# Altium schematic sheet 16-FPGA-02a.SchDoc
size B; SheetNumber: 16; SheetTotal: 22
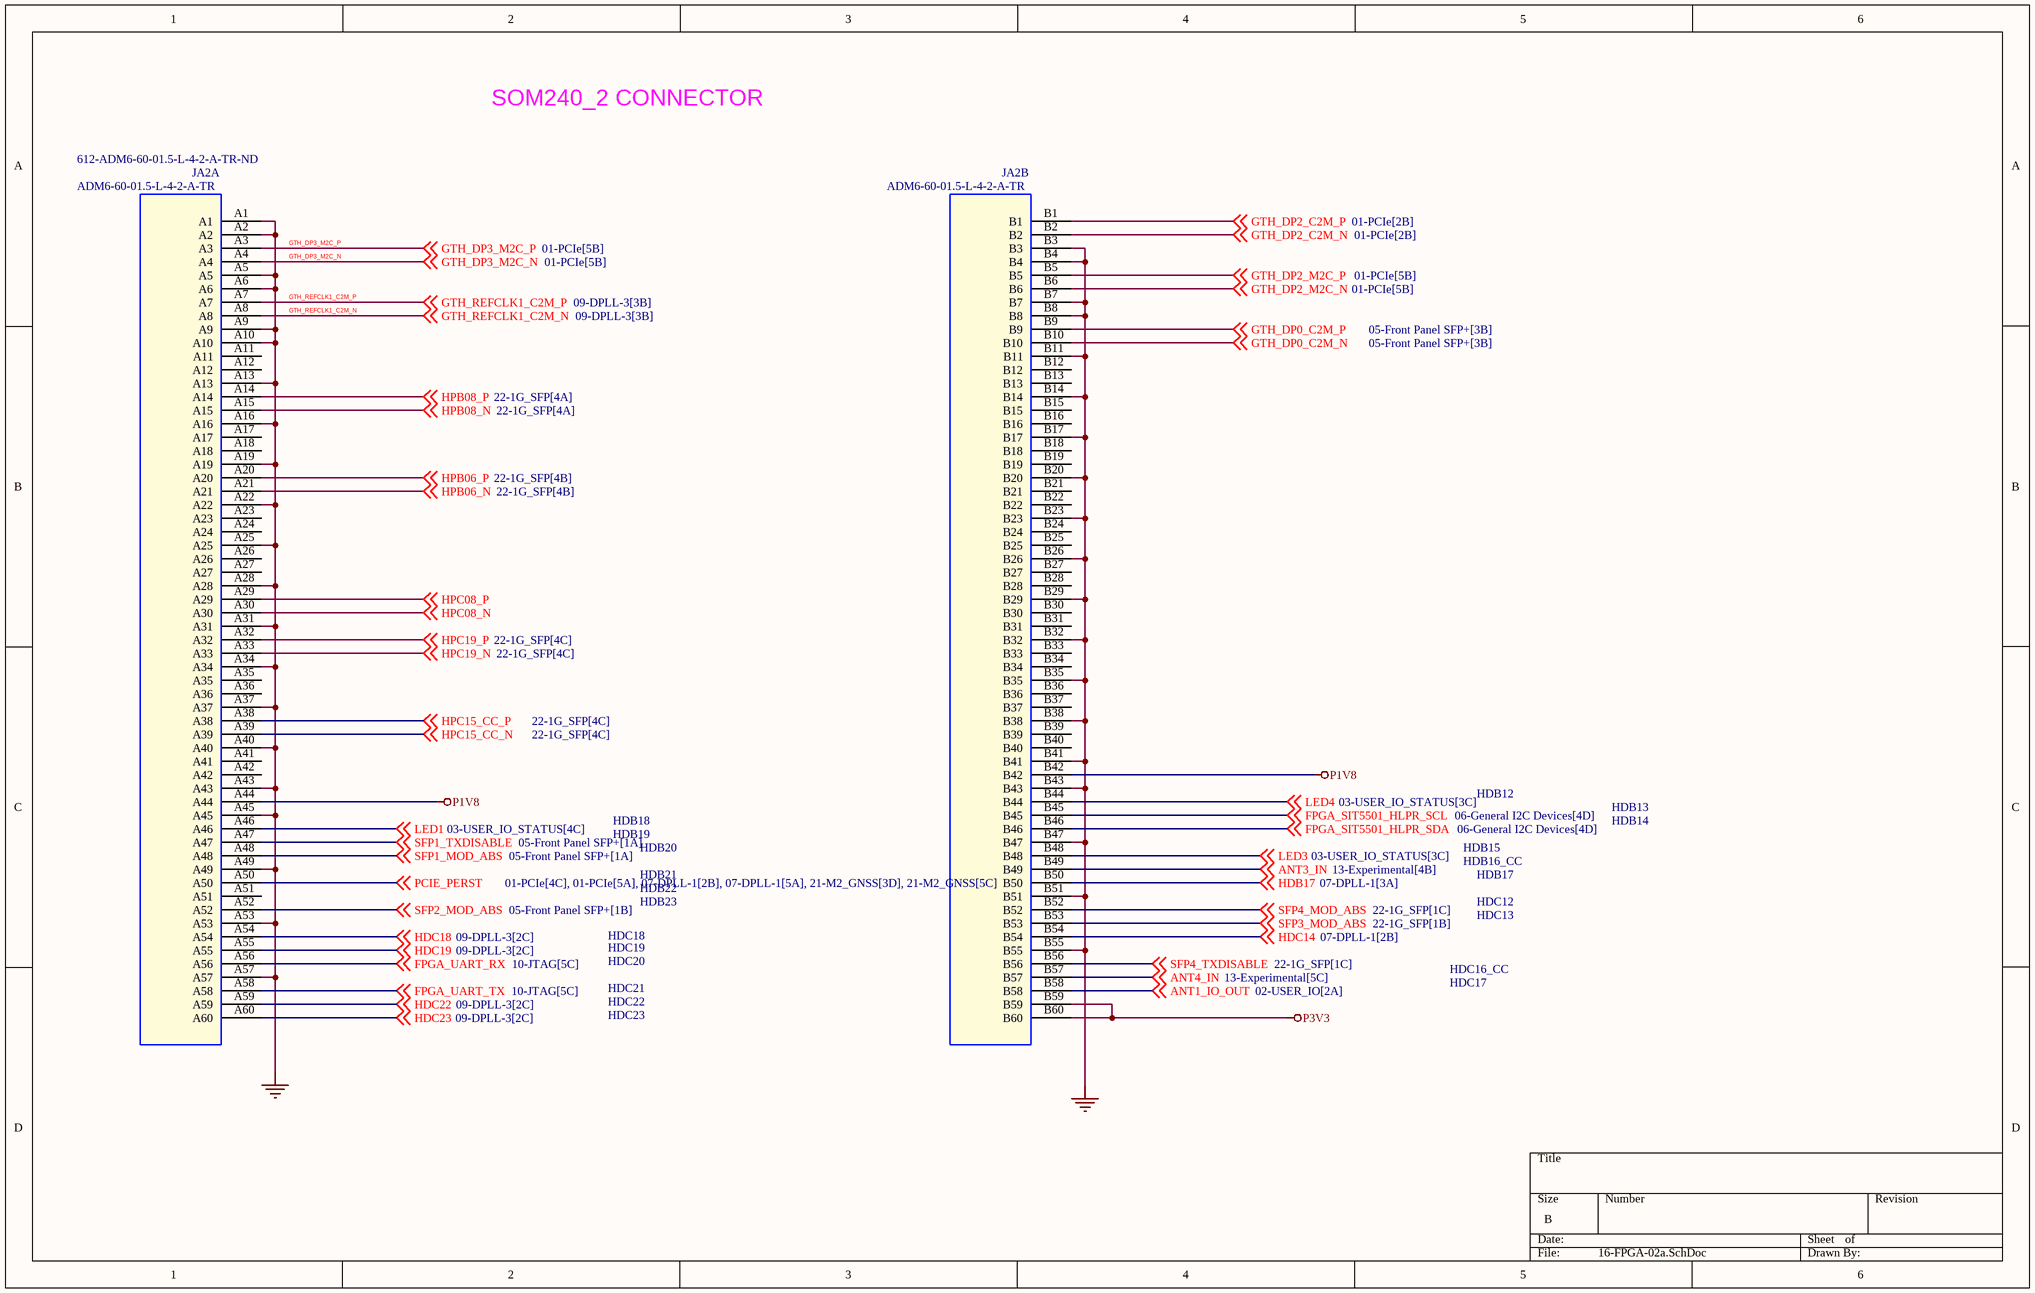
[diagram p0: 16-FPGA-02a.SchDoc]

## Parts
JA2  ADM6-60-01.5-L-4-2-A-TR  Supplier Part Number 1: 612-ADM6-60-01.5-L-4-2-A-TR-ND  [CON_SAMTEC_ADM6_60_4]  (parts A,B of 4)

## Nets
GND: JA2.A1 JA2.A2 JA2.A5 JA2.A6 JA2.A9 JA2.A10 JA2.A13 JA2.A16 JA2.A19 JA2.A22 JA2.A25 JA2.A28 JA2.A31 JA2.A34 JA2.A37 JA2.A40 JA2.A43 JA2.A45 JA2.A49 JA2.A53 JA2.A57 JA2.B3 JA2.B4 JA2.B7 JA2.B8 JA2.B11 JA2.B14 JA2.B17 JA2.B20 JA2.B23 JA2.B26 JA2.B29 JA2.B32 JA2.B35 JA2.B38 JA2.B41 JA2.B43 JA2.B47 JA2.B51 JA2.B55
P1V8: JA2.A44 JA2.B42
P3V3: JA2.B59 JA2.B60
ANT1_IO_OUT: JA2.B58 ; off-sheet ANT1_IO_OUT
ANT3_IN: JA2.B49 ; off-sheet ANT3_IN
ANT4_IN: JA2.B57 ; off-sheet ANT4_IN
FPGA_SIT5501_HLPR_SCL: JA2.B45 ; off-sheet FPGA_SIT5501_HLPR_SCL
FPGA_SIT5501_HLPR_SDA: JA2.B46 ; off-sheet FPGA_SIT5501_HLPR_SDA
FPGA_UART_RX: JA2.A56 ; off-sheet FPGA_UART_RX
FPGA_UART_TX: JA2.A58 ; off-sheet FPGA_UART_TX
GTH_DP0_C2M_N: JA2.B10 ; off-sheet GTH_DP0_C2M_N
GTH_DP0_C2M_P: JA2.B9 ; off-sheet GTH_DP0_C2M_P
GTH_DP2_C2M_N: JA2.B2 ; off-sheet GTH_DP2_C2M_N
GTH_DP2_C2M_P: JA2.B1 ; off-sheet GTH_DP2_C2M_P
GTH_DP2_M2C_N: JA2.B6 ; off-sheet GTH_DP2_M2C_N
GTH_DP2_M2C_P: JA2.B5 ; off-sheet GTH_DP2_M2C_P
GTH_DP3_M2C_N: JA2.A4 ; off-sheet GTH_DP3_M2C_N
GTH_DP3_M2C_P: JA2.A3 ; off-sheet GTH_DP3_M2C_P
GTH_REFCLK1_C2M_N: JA2.A8 ; off-sheet GTH_REFCLK1_C2M_N
GTH_REFCLK1_C2M_P: JA2.A7 ; off-sheet GTH_REFCLK1_C2M_P
HDB17: JA2.B50 ; off-sheet HDB17
HDC14: JA2.B54 ; off-sheet HDC14
HDC18: JA2.A54 ; off-sheet HDC18
HDC19: JA2.A55 ; off-sheet HDC19
HDC22: JA2.A59 ; off-sheet HDC22
HDC23: JA2.A60 ; off-sheet HDC23
HPB06_N: JA2.A21 ; off-sheet HPB06_N
HPB06_P: JA2.A20 ; off-sheet HPB06_P
HPB08_N: JA2.A15 ; off-sheet HPB08_N
HPB08_P: JA2.A14 ; off-sheet HPB08_P
HPC08_N: JA2.A30 ; off-sheet HPC08_N
HPC08_P: JA2.A29 ; off-sheet HPC08_P
HPC15_CC_N: JA2.A39 ; off-sheet HPC15_CC_N
HPC15_CC_P: JA2.A38 ; off-sheet HPC15_CC_P
HPC19_N: JA2.A33 ; off-sheet HPC19_N
HPC19_P: JA2.A32 ; off-sheet HPC19_P
LED1: JA2.A46 ; off-sheet LED1
LED3: JA2.B48 ; off-sheet LED3
LED4: JA2.B44 ; off-sheet LED4
PCIE_PERST: JA2.A50 ; off-sheet PCIE_PERST
SFP1_MOD_ABS: JA2.A48 ; off-sheet SFP1_MOD_ABS
SFP1_TXDISABLE: JA2.A47 ; off-sheet SFP1_TXDISABLE
SFP2_MOD_ABS: JA2.A52 ; off-sheet SFP2_MOD_ABS
SFP3_MOD_ABS: JA2.B53 ; off-sheet SFP3_MOD_ABS
SFP4_MOD_ABS: JA2.B52 ; off-sheet SFP4_MOD_ABS
SFP4_TXDISABLE: JA2.B56 ; off-sheet SFP4_TXDISABLE

Not connected (* = marked no-connect by the designer): JA2 A11 A12 A17 A18 A23 A24 A26 A27 A35 A36 A41 A42 A51 B12 B13 B15 B16 B18 B19 B21 B22 B24 B25 B27 B28 B30 B31 B33 B34 B36 B37 B39 B40

## Notes on the sheet
- SOM240_2 CONNECTOR
- HDB18
- HDB19
- HDB12
- HDB14
- HDB13
- HDB20
- HDB21
- HDB22
- HDB23
- HDB16_CC
- HDB15
- HDB17
- HDC12
- HDC18
- HDC19
- HDC20
- HDC16_CC
- HDC13
- HDC21
- HDC22
- HDC23
- HDC17

## Library data of the parts
JA2 = SAMTEC-ADx6-60X4: Conn Rcpt Male Vert 240 Pos 4x60 0.635mm P Black SMT; Manufacturer: Samtec Inc.; Agile Part Number: CON-00383-01; SPLIT_INST: TRUE; SWAP_INFO: (S1+S2+S3+S4); Barcode: 40000092; Pitch: 0.025" (0.64mm); Datasheet: http://suddendocs.samtec.com/catalog_english/adf6.pdf; Manufacturer PN: ADM6-60-01.5-L-4-2-A-TR; PCB Footprint: CON_SAMTEC_ADM6_60_4; Part Type: CONNECTOR; Number of Pins: 240; CIP Link: http://xsjbrdwin1/CIP-E/Component/Index/All?pn=40000092; Supplier 1: Digi-Key